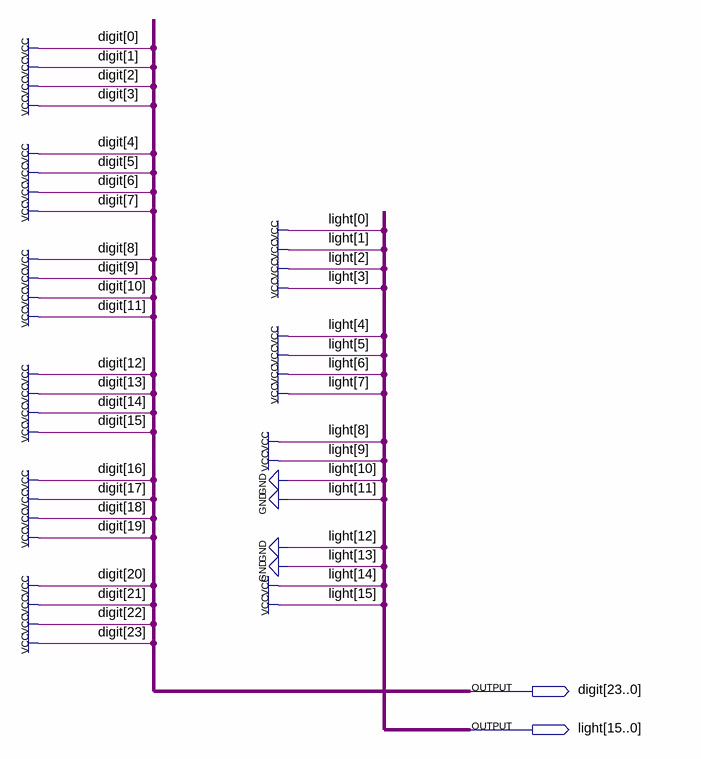
[diagram p0: schematic sheet]
// Quartus schematic Pattern_6_Frame_10.bdf as structural Verilog: 0 symbols, 2 pins
module Pattern_6_Frame_10 (
  output [23:0] digit,
  output [15:0] light
);


  assign digit = {24{1'b1}};
  assign light = 16'b1100001111111111;
endmodule
